# Altium schematic sheet Sheet1.SchDoc
size A4
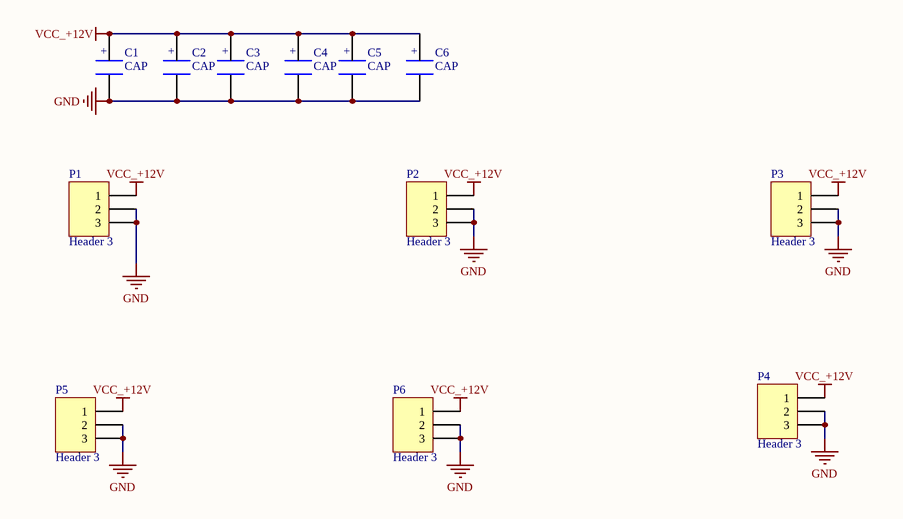
[diagram p0: Sheet1.SchDoc]

## Parts
C1  CAP  [8X12_CAP]
C2  CAP  [8X12_CAP]
C3  CAP  [8X12_CAP]
C4  CAP  [8X12_CAP]
C5  CAP  [8X12_CAP]
C6  CAP  [8X12_CAP]
P1  Header 3  [DC-005]
P2  Header 3  [DC-005]
P3  Header 3  [DC-005]
P4  Header 3  [DC-005]
P5  Header 3  [DC-005]
P6  Header 3  [DC-005]

## Nets
GND: C1.2 C2.2 C3.2 C4.2 C5.2 C6.2 P1.2 P1.3 P2.2 P2.3 P3.2 P3.3 P4.2 P4.3 P5.2 P5.3 P6.2 P6.3
VCC_+12V: C1.1 C2.1 C3.1 C4.1 C5.1 C6.1 P1.1 P2.1 P3.1 P4.1 P5.1 P6.1

## Notes on the sheet
- (in symbol CAP) +

## Library data of the parts
P1-P6 = Header 3: Header, 3-Pin; LatestRevisionDate: 17-Jul-2002; LatestRevisionNote: Re-released for DXP Platform.; Publisher: Altium Limited